# EasyEDA schematic wetterstation_easyeda.json
TITLE: ESP-Board; REV: 1.0; Date: 2021-11-25; Sheet: 1/1; Drawn By: Christian Gawron; Company: FH Südwestfalen
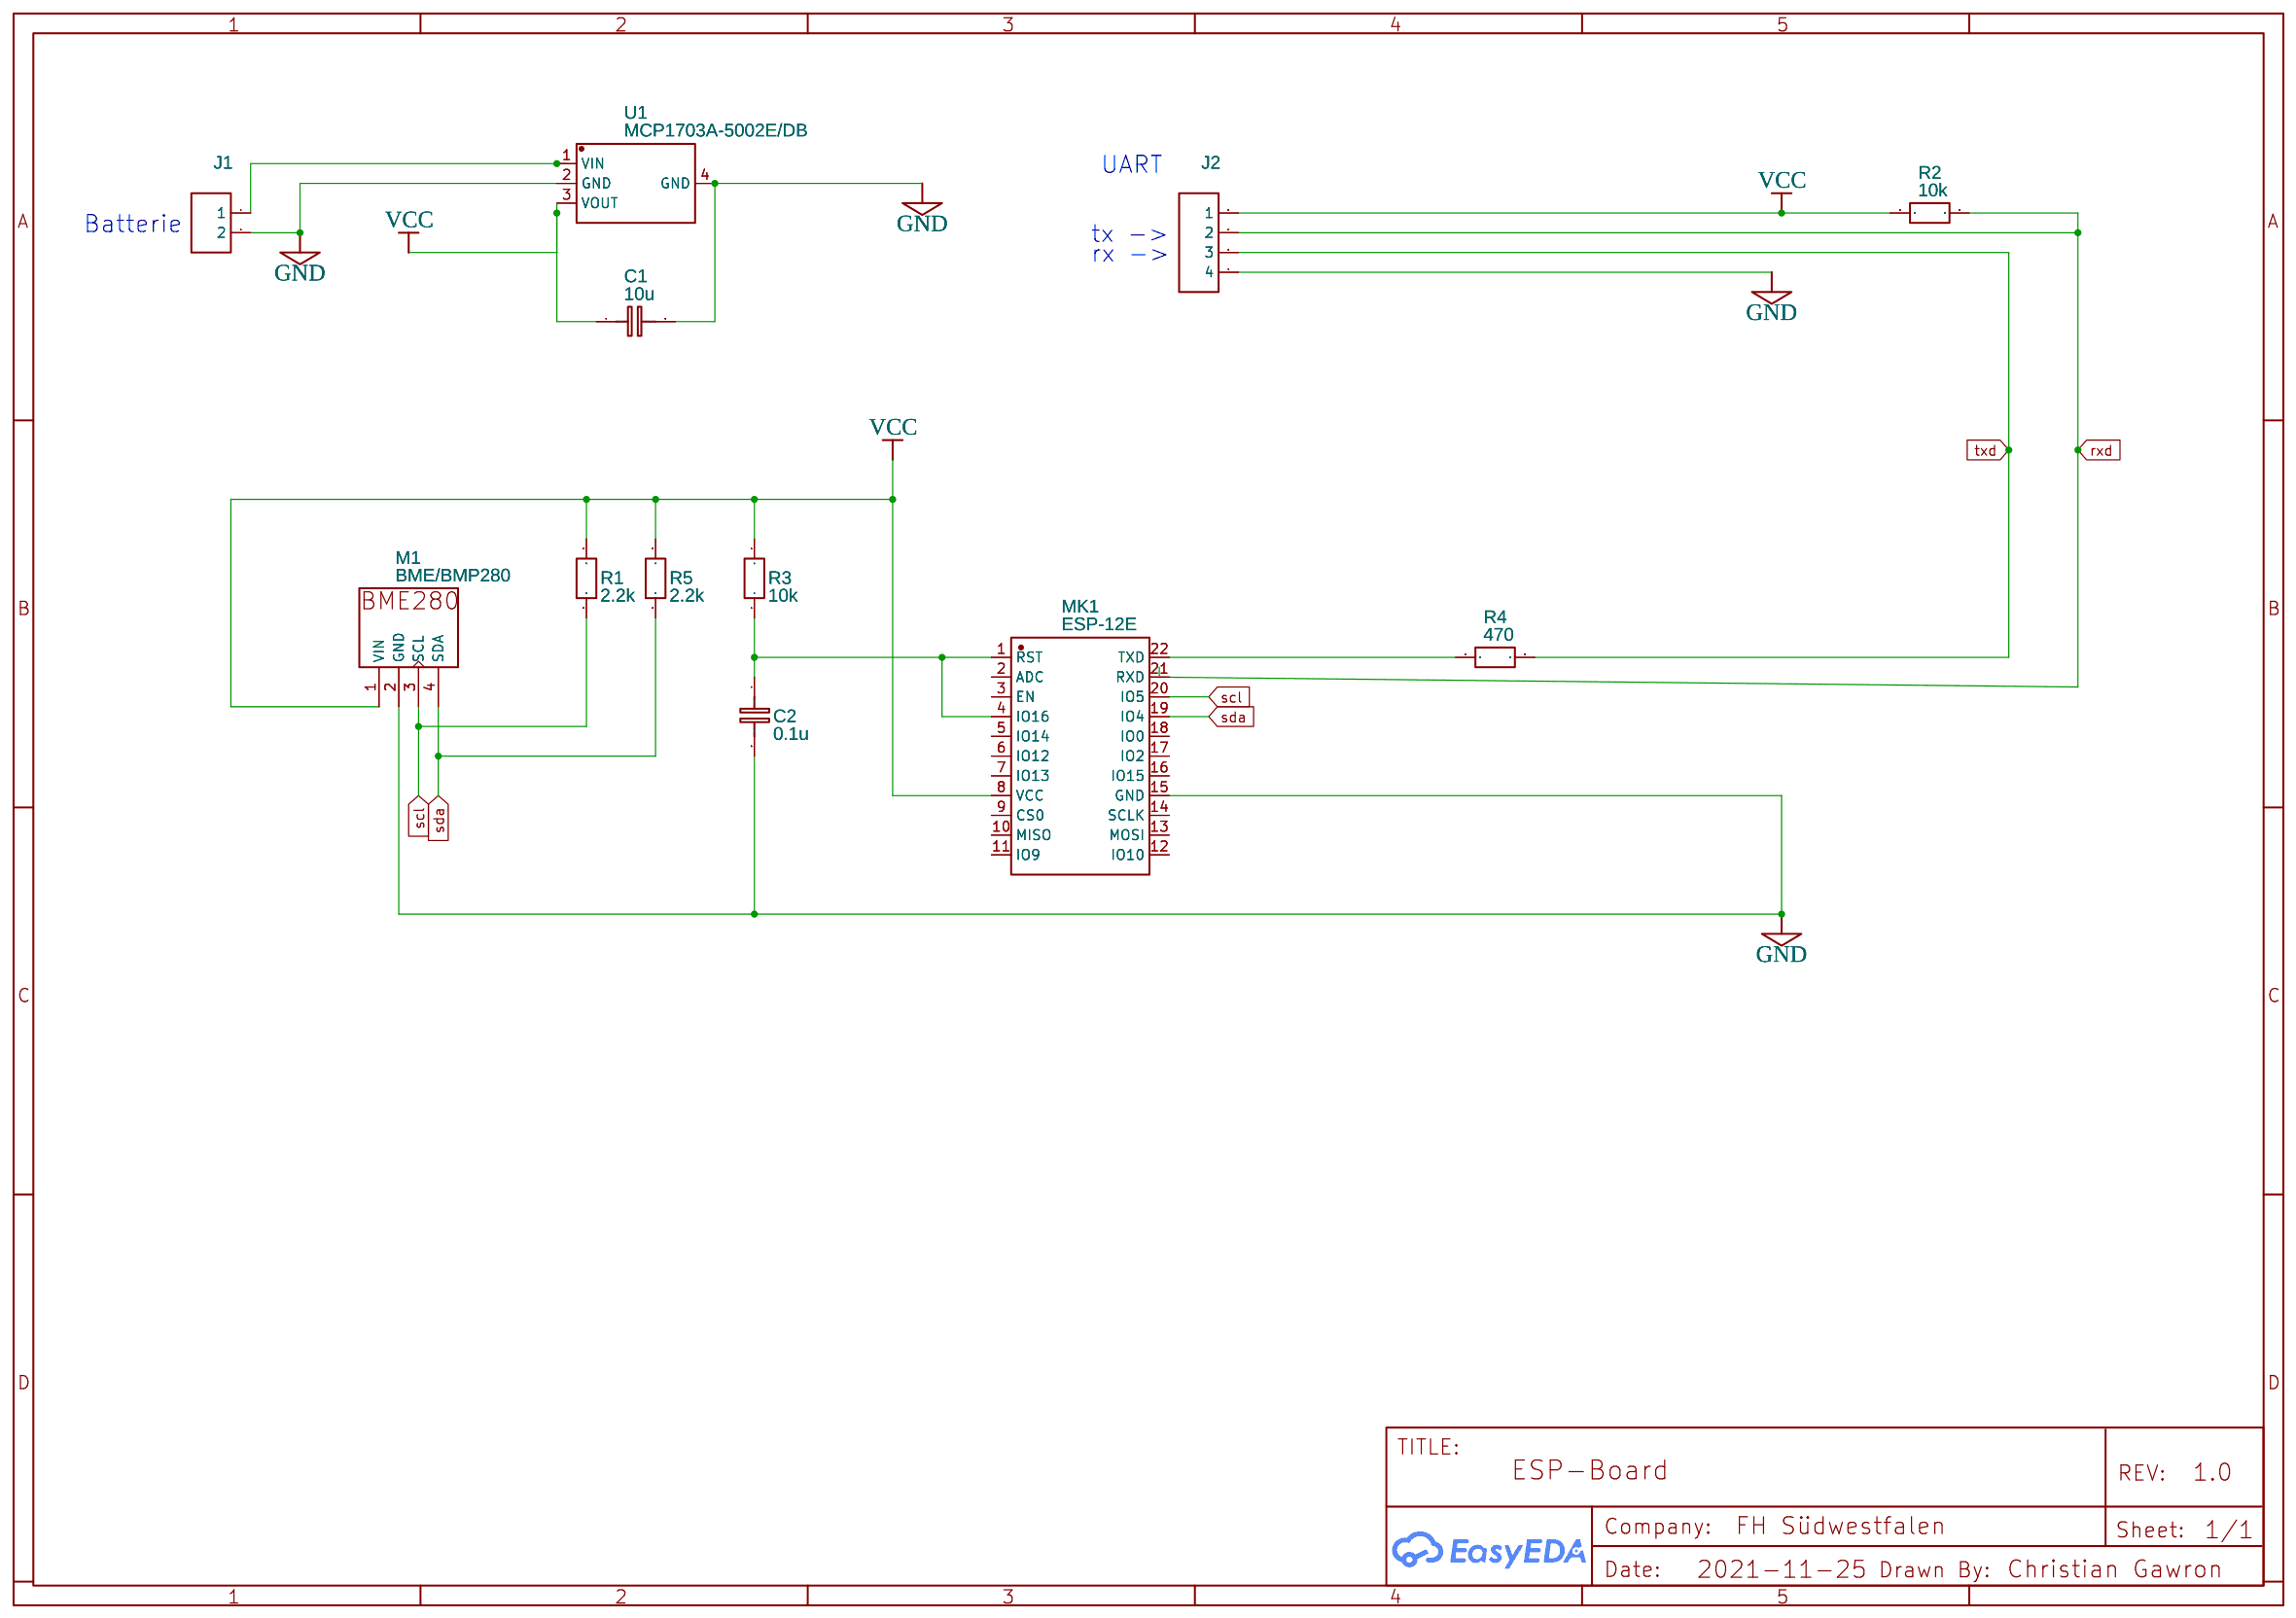
[diagram p0: schematic sheet]

## Parts
C1  10u  [C0603]
C2  0.1u  [C0805]
J1  HDR-M-2.54_1x2  [HDR-M-2.54_1X2]
J2  HDR-M-2.54_1x4  [HDR-M-2.54_1X4]
M1  BME/BMP280  [BME/BMP280]
MK1  ESP-12E  [WIFIM-SMD_ESP-12E-BR]
R1  2.2k  [R0603]
R2  10k  [R0603]
R3  10k  [R0603]
R4  470  [R0603]
R5  2.2k  [R0603]
U1  MCP1703A-5002E/DB  [SOT-223_L6.5-W3.5-P2.30-LS7.0-BR]

## Library data of the parts
C1 = C_0603_EU: Contributor: LCEDA_Lib
C2 = C_0805_EU: Contributor: LCEDA_Lib
J1 = HDR-M-2.54_1x2: Supplier Part: C124375; Supplier: LCSC; Contributor: LCEDA_Lib
J2 = HDR-M-2.54_1x4: Supplier Part: C124378; Supplier: LCSC; Contributor: LCEDA_Lib
M1 = BME/BMP280: Contributor: lehins
MK1 = ESP-12E: Supplier: LCSC; Manufacturer: Ai-Thinker; Supplier Part: C89297; JLCPCB Part Class: Extended Part
R1-R5 = R_0603_EU: Contributor: LCEDA_Lib
U1 = MCP1703A-5002E/DB: Supplier: LCSC; Supplier Part: C185652; Manufacturer: Microchip Tech; Contributor: LCSC; JLCPCB Part Class: Extended Part

## Nets
GND: C1.2 C2.2 J1.2 J2.4 M1.2(GND) MK1.15(GND) U1.2(GND) U1.4(GND)
VCC: C1.1 J2.1 M1.1(VIN) MK1.8(VCC) R1.2 R2.1 R3.2 R5.2 U1.3(VOUT)
rxd: J2.2 R2.2
scl: M1.3(SCL) MK1.20(IO5) R1.1
sda: M1.4(SDA) MK1.19(IO4) R5.1
txd: J2.3 R4.2
Net-(C2-1): C2.1 MK1.1(RST) MK1.4(IO16) R3.1
Net-(J1-1): J1.1 U1.1(VIN)
Net-(MK1-22): MK1.22(TXD) R4.1

Not connected (* = marked no-connect by the designer): MK1 2(ADC) 3(EN) 5(IO14) 6(IO12) 7(IO13) 9(CS0) 10(MISO) 11(IO9) 12(IO10) 13(MOSI) 14(SCLK) 16(IO15) 17(IO2) 18(IO0) 21(RXD)

## Notes on the sheet
- UART
- Batterie
- tx ->
- rx ->
